# Altium schematic sheet Pyro_Power.SchDoc
size A4; SheetNumber: 5; SheetTotal: 10
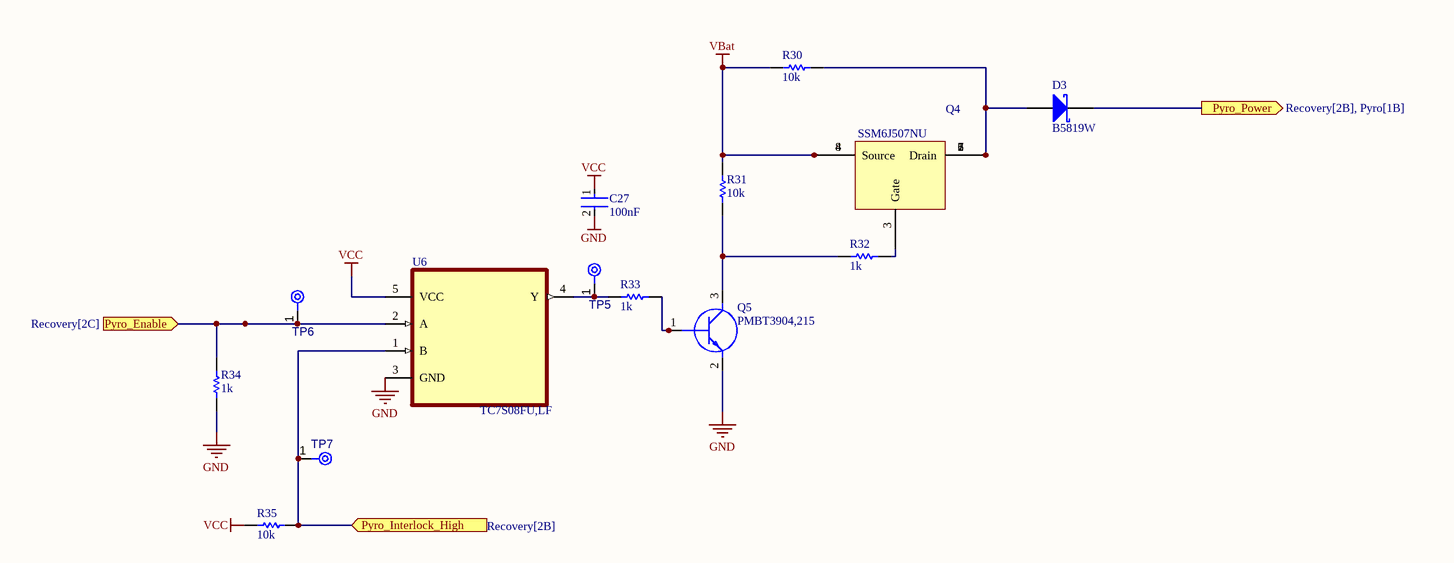
[diagram p0: Pyro_Power.SchDoc]

## Parts
C27  value 100nF  [FP-0603-L_1_6_0_15-W_0_81-IPC_C]  (hidden comment: Generic-Capacitor)
D3  B5819W  [MCC-SOD123_V]
Q4  SSM6J507NU  [SSM6J507NULF]
Q5  PMBT3904,215  [SOT95P230X110-3N]
R30  value 10k  [RESC1609X50X30ML8T20]  (hidden comment: Generic-Resistor)
R31  value 10k  [RESC1609X50X30ML8T20]  (hidden comment: Generic-Resistor)
R32  value 1k  [RESC1609X50X30ML8T20]  (hidden comment: Generic-Resistor)
R33  value 1k  [RESC1609X50X30ML8T20]  (hidden comment: Generic-Resistor)
R34  value 1k  [RESC1609X50X30ML8T20]  (hidden comment: Generic-Resistor)
R35  value 10k  [RESC1609X50X30ML8T20]  (hidden comment: Generic-Resistor)
TP5  TPAD6R  [TP06R]  (value not drawn)  (no BOM)
TP6  TPAD6R  [TP06R]  (value not drawn)  (no BOM)
TP7  TPAD6R  [TP06R]  (value not drawn)  (no BOM)
U6  TC7S08FU,LF  [SOT65P210X110-5N]

## Ports
Pyro_Enable (in, see Recovery[2C]), Pyro_Interlock_High (in, see Recovery[2B]), Pyro_Power (out, see Recovery[2B], Pyro[1B])

## Nets
GND: C27.2 Q5.2(E) R34.1 U6.3(GND)
VBat: Q4.4(Source) Q4.8 R30.1 R31.2
VCC: C27.1 R35.1 U6.5(VCC)
Pyro_Enable: R34.2 TP6.1(TP) U6.2(A) ; port Pyro_Enable
Pyro_Interlock_High: R35.2 TP7.1(TP) U6.1(B) ; port Pyro_Interlock_High
Pyro_Power: D3.2(K) ; port Pyro_Power
NetD3_1: D3.1(A) Q4.1(Drain) Q4.2 Q4.5 Q4.6 Q4.7 R30.2
NetQ4_3: Q4.3(Gate) R32.1
NetQ5_1: Q5.1(B) R33.1
NetQ5_3: Q5.3(C) R31.1 R32.2
NetR33_2: R33.2 TP5.1(TP) U6.4(Y)

## Library data of the parts
C27 = CMP-001-00088-6: Generic 0603 Capacitor; Dielectric: X7R; Voltage Rating: 50V; Tolerance: 10%; ESR: 0R; LCSC Part #: C14663; Case Code (Imperial): 0603
D3 = CMP-004-00005-3: Schottky Barrier Rectifier, 40 V, 1 A, -65 to 125 degC, 2-Pin SOD123, RoHS, Tape and Reel; Manufacturer: Micro Commercial Components; Datasheet Version: Rev. B, 01/2013; RoHS Compliant: Unknown; Manufacturer URL: http://www.mccsemi.com/; Package URL: http://www.mccsemi.com/up_pdf/1N4448W(SOD-123).pdf; Case/Package: SOD123; Mounting Technology: SM; Datasheet URL: http://www.mccsemi.com/up_pdf/B5817W-B5819W(SOD-123).pdf; Package Description: 2-Pin Small Outline Diode, Body 2.7 x 1.6 mm, Height 1.35 mm; Package Reference: SOD123; LCSC Part #: C8598
Q4 = CMP-013-000003-10: MOSFET Small Signal MOSFET V=30V; Manufacturer_Name: Toshiba; Manufacturer_Part_Number: SSM6J507NU,LF; Datasheet Link: https://toshiba.semicon-storage.com/info/SSM6J507NU_datasheet_en_20151110.pdf?did=30372&prodName=SSM6J507NU; Mouser Price/Stock: https://www.mouser.co.uk/ProductDetail/Toshiba/SSM6J507NULF?qs=YeFsEeYZIJmLsTAyWirtAw%3D%3D; Mouser Part Number: 757-SSM6J507NULF; Height: 0.8mm; Design Item ID: SSM6J507NU,LF; Source: SamacSys.SchLib; LCSC Part #: C146318
Q5 = CMP-013-000004-1: PMBT3904 - NPN switching transistor; Manufacturer_Name: Nexperia; Arrow Price/Stock: https://www.arrow.com/en/products/pmbt3904215/nexperia?region=europe; Design Item ID: PMBT3904,215; Datasheet Link: https://assets.nexperia.com/documents/data-sheet/PMBT3904.pdf; Manufacturer_Part_Number: PMBT3904,215; Arrow Part Number: PMBT3904,215; Mouser Part Number: 771-PMBT3904-T/R; Source: SamacSys.SchLib; Mouser Price/Stock: https://www.mouser.co.uk/ProductDetail/Nexperia/PMBT3904215?qs=LOCUfHb8d9tXximHEgx1nw%3D%3D; Height: 1.1mm; LCSC Part #: C8667
R30-R35 = CMP-009-00185-4: Generic 0603 Resistor; Power Rating: 100mW; Tolerance: 0%; Voltage Rating: 75V; Case Code (Metric): 1608; Case Code (Imperial): 0603
  R30 R31 R35: LCSC Part #: C25804
  R32-R34: LCSC Part #: C21190
TP5-TP7 = CMP-00028-00002-2: 0.6mm round; Pins: 1
U6 = CMP-064-000000-3: Single 2-input AND gate; MP: TC7S08FU,LF; Package: None; Price: None; Availability: Unavailable; Value: *; Pin Count: 5; Component Type: Standard; Design Item ID: TC7S08FU,LF; LCSC Part #: C146362